# EAGLE design main (EAGLE 6.6.0)
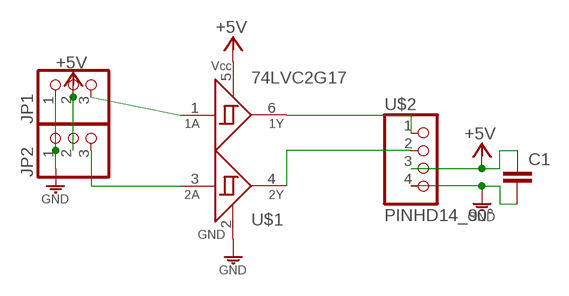
[diagram p0: schematic, sheet 1]

## Parts
C1  MLCC-2  [MLCC_25]
JP1  PINHD-13_90°  [1*3_90]
JP2  PINHD-13_90°  [1*3_90]
U$1  74LVC2G17  [74LVC2G17]
U$2  PINHD14_90°  [1*4_90]

## Nets
+5V: C1.1 JP1.2 JP2.2 U$1.5 U$2.3
GND: C1.2 JP1.1 JP2.1 U$1.2 U$2.4
N$1: U$1.6 U$2.1
N$2: U$1.4 U$2.2
N$3: JP1.3 U$1.1
N$4: JP2.3 U$1.3

## Library data of the parts
C1 = rcl__s:MLCC: CAPACITOR, European symbol
JP1 JP2 = pinhead_s:PINHD-1*3_90°
U$1 = 74LVC2G17:74LVC2G17
U$2 = pinhead_s:PINHD1*4_90°

## Board
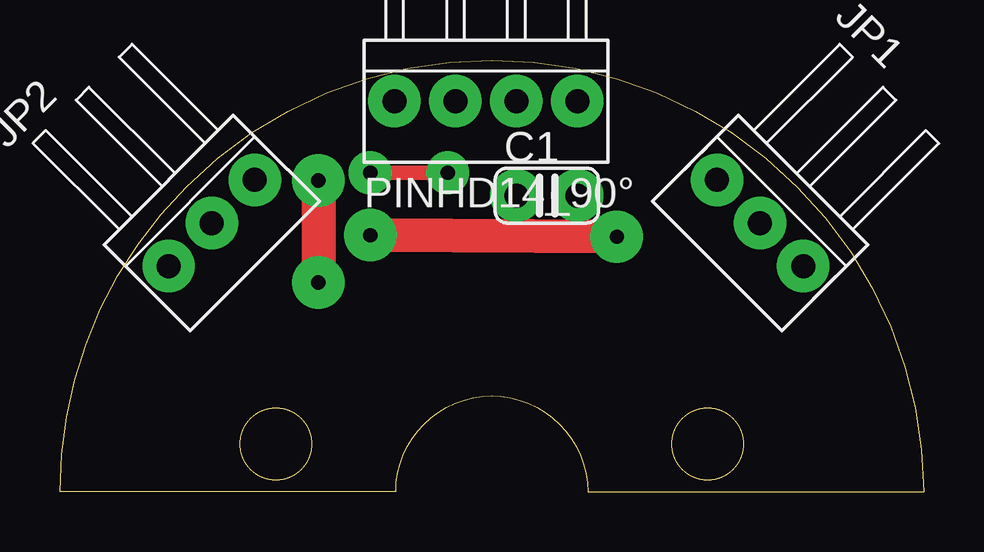
[diagram p1: board, top side]
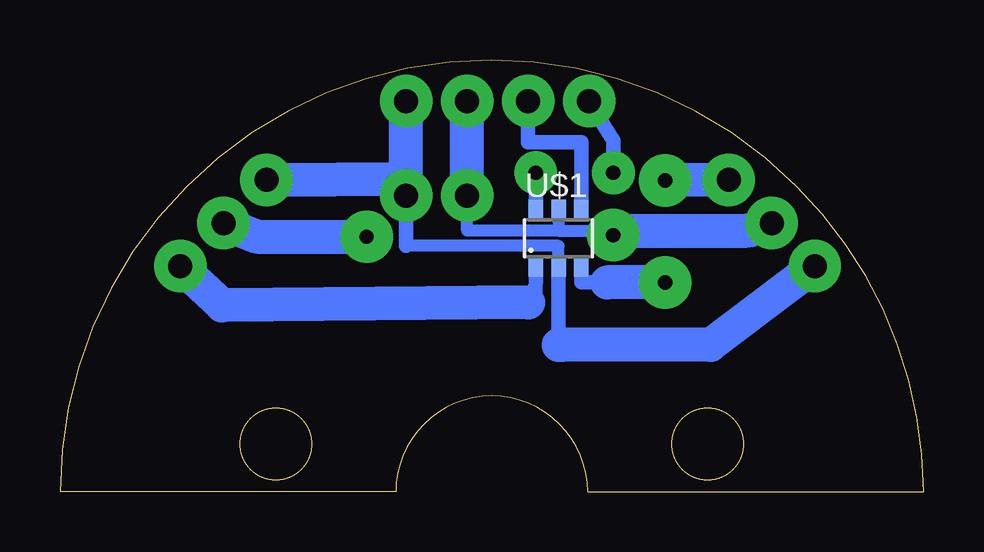
[diagram p2: board, bottom side, seen from below]

Size 36 x 18 mm. Coordinates in mm from the lower left corner, seen from the top.
Outline: 5.27,12.73 arc-135 36,0 22,0 arc180 14,0 0,0 arc-45 5.27,12.73
Outline: circle at 27,2 radius 1.5
Outline: circle at 9,2 radius 1.5
Copper layers (1*16): Top 0.035mm / dielectric 1.5mm / Bottom 0.035mm
Design rules "default": minimum track width 10mil, minimum drill 24mil, track to track 8mil, track to pad 8mil, pad to pad 8mil, via to via 8mil, smd to smd 8mil, copper to edge 40mil, drill to drill 8mil, minimum pad ring 10mil, minimum via ring 8mil, stop-mask expansion 4mil, vias tented up to drill 0mil, thermal gap 10mil

### Footprints (pad centres in the part's own frame; a part is rotated, then mirrored left to right if it is on the bottom)
MLCC_25 = drill 1 pad 2.184: 1 -1.27,0; 2 1.27,0
1*3_90 = drill 1 pad 2.184: 1 -2.54,0; 2 0,0; 3 2.54,0
74LVC2G17 = smd 0.6 x 0.9: 1 -0.95,-1.15; 2 0,-1.15; 3 0.95,-1.15; 4 0.95,1.15; 5 0,1.15; 6 -0.95,1.15
1*4_90 = drill 1 pad 2.184: 1 -3.81,0; 2 -1.27,0; 3 1.27,0; 4 3.81,0

### Placement (x,y rotation side)
C1  20.3,12.35 0 top
JP1  29.19,11.21 315 top
JP2  6.33,11.21 45 top
U$1  15.22,10.57 0 bottom
U$2  17.76,16.29 0 top

### Tracks (layer width: path | path; a pad name or v marks a point on that pad's centre or on a via)
+5V  (via drill 0.6 pad 2.18)
  Top 1.422: v23.22,10.64 v12.93,10.7
  Bottom 0.508: 15.22,10.89 U$1.5 15.22,10.89 | 15.22,10.89 19.03,10.89 C1.1 | 15.22,10.89 13.12,10.89
  Bottom 1.422: C1.1 U$2.3 | 13.12,10.89 12.74,10.89 | 12.74,10.89 7.34,10.89 JP2.2 | JP1.2 27.79,10.64 v23.22,10.64 | v12.93,10.7 13.06,10.83 12.74,10.89
GND
  Bottom 0.508: 15.09,6.13 15.22,6.13 15.22,10.25 21.57,10.25
  Bottom 0.61: 15.22,6.13 U$1.2 15.22,6.13 | 15.22,6.13 15.09,6.13 15.22,6.13 | 21.57,10.25 C1.2
  Bottom 1.422: C1.2 21.57,13.05 | 21.57,13.05 U$2.4 | JP2.1 8.87,6.13 15.09,6.13 15.22,6.13 | JP1.1 21.57,13.05
N$1  (via drill 0.6 pad 1.78)
  Top 0.61: v16.17,13.3 v12.93,13.3
  Bottom 0.61: U$1.6 v16.17,13.3 | v12.93,13.3 12.93,14.64 U$2.1
N$2
  Bottom 0.61: U$1.4 14.26,12.8 14.26,14.57 16.49,14.57 U$2.2
N$3
  Bottom 0.61: U$1.1 16.17,7.91 16.49,7.91
  Bottom 1.422: 16.49,7.91 29.25,7.78 JP1.3
N$4  (via drill 0.6 pad 2.18)
  Top 1.422: v10.77,12.99 v10.77,8.73
  Bottom 0.61: U$1.3 14.26,8.73 13.18,8.73
  Bottom 1.422: JP2.3 v10.77,12.99 | v10.77,8.73 13.18,8.73